# Vivado block design finn_stitched, xczu3eg-sbva484-1-i, Vivado 2020.2
create_bd_design finn_stitched

create_bd_intf_port -mode Slave -vlnv xilinx.com:interface:axis_rtl:1.0 s_axis
set_property -dict [list \
  CONFIG.FREQ_HZ 100000000.000000 \
  CONFIG.HAS_TKEEP 0 \
  CONFIG.HAS_TLAST 0 \
  CONFIG.HAS_TREADY 1 \
  CONFIG.HAS_TSTRB 0 \
  CONFIG.LAYERED_METADATA undef \
  CONFIG.TDATA_NUM_BYTES 1 \
  CONFIG.TDEST_WIDTH 0 \
  CONFIG.TID_WIDTH 0 \
  CONFIG.TUSER_WIDTH 0 \
] [get_bd_intf_ports s_axis]
create_bd_intf_port -mode Master -vlnv xilinx.com:interface:axis_rtl:1.0 m_axis
set_property -dict {CONFIG.FREQ_HZ 100000000.000000} [get_bd_intf_ports m_axis]
create_bd_port -dir I -type clk ap_clk
set_property -dict {CONFIG.FREQ_HZ 100000000.000000} [get_bd_ports ap_clk]
create_bd_port -dir I -type rst ap_rst_n

create_bd_cell -type hier finn_ip

# ---- hierarchy /finn_ip ----
current_bd_instance /finn_ip
create_bd_intf_pin -mode Slave -vlnv xilinx.com:interface:axis_rtl:1.0 s_axis_0
create_bd_intf_pin -mode Master -vlnv xilinx.com:interface:axis_rtl:1.0 m_axis_0
create_bd_pin -dir I -type clk ap_clk
create_bd_pin -dir I -type rst ap_rst_n

create_bd_cell -type ip -vlnv xilinx.com:hls:StreamingFIFO_0:1.0 StreamingFIFO_0
create_bd_cell -type ip -vlnv xilinx.com:hls:Thresholding_Batch_0:1.0 Thresholding_Batch_0
create_bd_cell -type ip -vlnv xilinx.com:hls:StreamingFIFO_1:1.0 StreamingFIFO_1
create_bd_cell -type ip -vlnv xilinx.com:hls:FMPadding_Batch_0:1.0 FMPadding_Batch_0
create_bd_cell -type hier StreamingFIFO_2
create_bd_cell -type ip -vlnv xilinx.com:hls:ConvolutionInputGenerator_0:1.0 ConvolutionInputGenerator_0
create_bd_cell -type ip -vlnv xilinx.com:hls:StreamingDataWidthConverter_Batch_0:1.0 StreamingDataWidthConverter_Batch_0
create_bd_cell -type hier StreamingFIFO_4
create_bd_cell -type hier StreamingFCLayer_Batch_0
create_bd_cell -type ip -vlnv xilinx.com:hls:StreamingDataWidthConverter_Batch_1:1.0 StreamingDataWidthConverter_Batch_1
create_bd_cell -type ip -vlnv xilinx.com:hls:StreamingFIFO_6:1.0 StreamingFIFO_6
create_bd_cell -type ip -vlnv xilinx.com:hls:StreamingMaxPool_Batch_0:1.0 StreamingMaxPool_Batch_0
create_bd_cell -type ip -vlnv xilinx.com:hls:StreamingFIFO_7:1.0 StreamingFIFO_7
create_bd_cell -type ip -vlnv xilinx.com:hls:StreamingDataWidthConverter_Batch_2:1.0 StreamingDataWidthConverter_Batch_2
create_bd_cell -type hier StreamingFIFO_8
create_bd_cell -type ip -vlnv xilinx.com:hls:FMPadding_Batch_1:1.0 FMPadding_Batch_1
create_bd_cell -type ip -vlnv xilinx.com:hls:StreamingDataWidthConverter_Batch_3:1.0 StreamingDataWidthConverter_Batch_3
create_bd_cell -type hier StreamingFIFO_10
create_bd_cell -type ip -vlnv xilinx.com:hls:ConvolutionInputGenerator_1:1.0 ConvolutionInputGenerator_1
create_bd_cell -type ip -vlnv xilinx.com:hls:StreamingDataWidthConverter_Batch_4:1.0 StreamingDataWidthConverter_Batch_4
create_bd_cell -type ip -vlnv xilinx.com:hls:StreamingFIFO_12:1.0 StreamingFIFO_12
create_bd_cell -type hier StreamingFCLayer_Batch_1
create_bd_cell -type ip -vlnv xilinx.com:hls:StreamingDataWidthConverter_Batch_5:1.0 StreamingDataWidthConverter_Batch_5
create_bd_cell -type ip -vlnv xilinx.com:hls:StreamingMaxPool_Batch_1:1.0 StreamingMaxPool_Batch_1
create_bd_cell -type ip -vlnv xilinx.com:hls:StreamingFIFO_15:1.0 StreamingFIFO_15
create_bd_cell -type ip -vlnv xilinx.com:hls:StreamingDataWidthConverter_Batch_6:1.0 StreamingDataWidthConverter_Batch_6
create_bd_cell -type hier StreamingFIFO_16
create_bd_cell -type ip -vlnv xilinx.com:hls:FMPadding_Batch_2:1.0 FMPadding_Batch_2
create_bd_cell -type hier StreamingFIFO_17
create_bd_cell -type ip -vlnv xilinx.com:hls:ConvolutionInputGenerator_2:1.0 ConvolutionInputGenerator_2
create_bd_cell -type ip -vlnv xilinx.com:hls:StreamingDataWidthConverter_Batch_7:1.0 StreamingDataWidthConverter_Batch_7
create_bd_cell -type ip -vlnv xilinx.com:hls:StreamingFIFO_19:1.0 StreamingFIFO_19
create_bd_cell -type hier StreamingFCLayer_Batch_2
create_bd_cell -type ip -vlnv xilinx.com:hls:StreamingDataWidthConverter_Batch_8:1.0 StreamingDataWidthConverter_Batch_8
create_bd_cell -type ip -vlnv xilinx.com:hls:StreamingMaxPool_Batch_2:1.0 StreamingMaxPool_Batch_2
create_bd_cell -type ip -vlnv xilinx.com:hls:StreamingFIFO_22:1.0 StreamingFIFO_22
create_bd_cell -type ip -vlnv xilinx.com:hls:StreamingDataWidthConverter_Batch_9:1.0 StreamingDataWidthConverter_Batch_9
create_bd_cell -type hier StreamingFIFO_23
create_bd_cell -type ip -vlnv xilinx.com:hls:FMPadding_Batch_3:1.0 FMPadding_Batch_3
create_bd_cell -type hier StreamingFIFO_24
create_bd_cell -type ip -vlnv xilinx.com:hls:ConvolutionInputGenerator_3:1.0 ConvolutionInputGenerator_3
create_bd_cell -type ip -vlnv xilinx.com:hls:StreamingDataWidthConverter_Batch_10:1.0 StreamingDataWidthConverter_Batch_10
create_bd_cell -type hier StreamingFIFO_26
create_bd_cell -type hier StreamingFCLayer_Batch_3
create_bd_cell -type ip -vlnv xilinx.com:hls:StreamingDataWidthConverter_Batch_11:1.0 StreamingDataWidthConverter_Batch_11
create_bd_cell -type ip -vlnv xilinx.com:hls:StreamingMaxPool_Batch_3:1.0 StreamingMaxPool_Batch_3
create_bd_cell -type ip -vlnv xilinx.com:hls:StreamingFIFO_29:1.0 StreamingFIFO_29
create_bd_cell -type ip -vlnv xilinx.com:hls:StreamingDataWidthConverter_Batch_12:1.0 StreamingDataWidthConverter_Batch_12
create_bd_cell -type hier StreamingFIFO_30
create_bd_cell -type ip -vlnv xilinx.com:hls:FMPadding_Batch_4:1.0 FMPadding_Batch_4
create_bd_cell -type hier StreamingFIFO_31
create_bd_cell -type ip -vlnv xilinx.com:hls:ConvolutionInputGenerator_4:1.0 ConvolutionInputGenerator_4
create_bd_cell -type ip -vlnv xilinx.com:hls:StreamingDataWidthConverter_Batch_13:1.0 StreamingDataWidthConverter_Batch_13
create_bd_cell -type hier StreamingFIFO_33
create_bd_cell -type hier StreamingFCLayer_Batch_4
create_bd_cell -type ip -vlnv xilinx.com:hls:StreamingDataWidthConverter_Batch_14:1.0 StreamingDataWidthConverter_Batch_14
create_bd_cell -type ip -vlnv xilinx.com:hls:StreamingMaxPool_Batch_4:1.0 StreamingMaxPool_Batch_4
create_bd_cell -type ip -vlnv xilinx.com:hls:StreamingFIFO_36:1.0 StreamingFIFO_36
create_bd_cell -type ip -vlnv xilinx.com:hls:StreamingDataWidthConverter_Batch_15:1.0 StreamingDataWidthConverter_Batch_15
create_bd_cell -type hier StreamingFIFO_37
create_bd_cell -type ip -vlnv xilinx.com:hls:FMPadding_Batch_5:1.0 FMPadding_Batch_5
create_bd_cell -type hier StreamingFIFO_38
create_bd_cell -type ip -vlnv xilinx.com:hls:ConvolutionInputGenerator_5:1.0 ConvolutionInputGenerator_5
create_bd_cell -type ip -vlnv xilinx.com:hls:StreamingDataWidthConverter_Batch_16:1.0 StreamingDataWidthConverter_Batch_16
create_bd_cell -type hier StreamingFIFO_40
create_bd_cell -type hier StreamingFCLayer_Batch_5
create_bd_cell -type ip -vlnv xilinx.com:hls:StreamingDataWidthConverter_Batch_17:1.0 StreamingDataWidthConverter_Batch_17
create_bd_cell -type ip -vlnv xilinx.com:hls:StreamingMaxPool_Batch_5:1.0 StreamingMaxPool_Batch_5
create_bd_cell -type ip -vlnv xilinx.com:hls:StreamingDataWidthConverter_Batch_18:1.0 StreamingDataWidthConverter_Batch_18
create_bd_cell -type hier StreamingFIFO_44
create_bd_cell -type ip -vlnv xilinx.com:hls:FMPadding_Batch_6:1.0 FMPadding_Batch_6
create_bd_cell -type hier StreamingFIFO_45
create_bd_cell -type ip -vlnv xilinx.com:hls:ConvolutionInputGenerator_6:1.0 ConvolutionInputGenerator_6
create_bd_cell -type ip -vlnv xilinx.com:hls:StreamingDataWidthConverter_Batch_19:1.0 StreamingDataWidthConverter_Batch_19
create_bd_cell -type hier StreamingFIFO_47
create_bd_cell -type hier StreamingFCLayer_Batch_6
create_bd_cell -type ip -vlnv xilinx.com:hls:StreamingDataWidthConverter_Batch_20:1.0 StreamingDataWidthConverter_Batch_20
create_bd_cell -type ip -vlnv xilinx.com:hls:StreamingMaxPool_Batch_6:1.0 StreamingMaxPool_Batch_6
create_bd_cell -type ip -vlnv xilinx.com:hls:StreamingDataWidthConverter_Batch_21:1.0 StreamingDataWidthConverter_Batch_21
create_bd_cell -type hier StreamingFCLayer_Batch_7
create_bd_cell -type ip -vlnv xilinx.com:hls:StreamingDataWidthConverter_Batch_22:1.0 StreamingDataWidthConverter_Batch_22
create_bd_cell -type hier StreamingFCLayer_Batch_8
create_bd_cell -type ip -vlnv xilinx.com:hls:StreamingDataWidthConverter_Batch_23:1.0 StreamingDataWidthConverter_Batch_23
create_bd_cell -type hier StreamingFCLayer_Batch_9

# ---- hierarchy /finn_ip/StreamingFIFO_2 ----
current_bd_instance /finn_ip/StreamingFIFO_2
create_bd_intf_pin -mode Master -vlnv xilinx.com:interface:axis_rtl:1.0 out_V
create_bd_intf_pin -mode Slave -vlnv xilinx.com:interface:axis_rtl:1.0 in0_V
create_bd_pin -dir I -type clk ap_clk
create_bd_pin -dir I -type rst ap_rst_n

create_bd_cell -type ip -vlnv xilinx.com:ip:axis_data_fifo:2.0 fifo
set_property -dict {CONFIG.FIFO_DEPTH 4096 CONFIG.FIFO_MEMORY_TYPE auto CONFIG.TDATA_NUM_BYTES 1} [get_bd_cells fifo]

# ---- hierarchy /finn_ip/StreamingFIFO_4 ----
current_bd_instance /finn_ip/StreamingFIFO_4
create_bd_intf_pin -mode Master -vlnv xilinx.com:interface:axis_rtl:1.0 out_V
create_bd_intf_pin -mode Slave -vlnv xilinx.com:interface:axis_rtl:1.0 in0_V
create_bd_pin -dir I -type clk ap_clk
create_bd_pin -dir I -type rst ap_rst_n

create_bd_cell -type ip -vlnv xilinx.com:ip:axis_data_fifo:2.0 fifo
set_property -dict {CONFIG.FIFO_DEPTH 2048 CONFIG.FIFO_MEMORY_TYPE auto CONFIG.TDATA_NUM_BYTES 3} [get_bd_cells fifo]

# ---- hierarchy /finn_ip/StreamingFCLayer_Batch_0 ----
current_bd_instance /finn_ip/StreamingFCLayer_Batch_0
create_bd_intf_pin -mode Master -vlnv xilinx.com:interface:axis_rtl:1.0 out_V
create_bd_intf_pin -mode Slave -vlnv xilinx.com:interface:axis_rtl:1.0 in0_V
create_bd_pin -dir I -type clk ap_clk
create_bd_pin -dir I -type rst ap_rst_n

create_bd_cell -type ip -vlnv xilinx.com:hls:StreamingFCLayer_Batch_0:1.0 StreamingFCLayer_Batch_0
create_bd_cell -type ip -vlnv xilinx.com:user:memstream:1.0 StreamingFCLayer_Batch_0_wstrm
set_property -dict [list \
  CONFIG.MEM_DEPTH 36 \
  CONFIG.MEM_INIT /home/nm/FINN/hls_2020_2/finn/notebooks/end2end_example/cnv_w1a2_resize_regression_ressource/source_IPs/src_ips/code_gen_ipgen_StreamingFCLayer_Batch_0_kivh_mzu/ \
  CONFIG.MEM_WIDTH 48 \
  CONFIG.NSTREAMS 1 \
  CONFIG.RAM_STYLE distributed \
  CONFIG.STRM0_DEPTH 36 \
  CONFIG.STRM0_OFFSET 0 \
  CONFIG.STRM0_WIDTH 48 \
] [get_bd_cells StreamingFCLayer_Batch_0_wstrm]

# ---- hierarchy /finn_ip/StreamingFIFO_8 ----
current_bd_instance /finn_ip/StreamingFIFO_8
create_bd_intf_pin -mode Master -vlnv xilinx.com:interface:axis_rtl:1.0 out_V
create_bd_intf_pin -mode Slave -vlnv xilinx.com:interface:axis_rtl:1.0 in0_V
create_bd_pin -dir I -type clk ap_clk
create_bd_pin -dir I -type rst ap_rst_n

create_bd_cell -type ip -vlnv xilinx.com:ip:axis_data_fifo:2.0 fifo
set_property -dict {CONFIG.FIFO_DEPTH 1024 CONFIG.FIFO_MEMORY_TYPE auto CONFIG.TDATA_NUM_BYTES 1} [get_bd_cells fifo]

# ---- hierarchy /finn_ip/StreamingFIFO_10 ----
current_bd_instance /finn_ip/StreamingFIFO_10
create_bd_intf_pin -mode Master -vlnv xilinx.com:interface:axis_rtl:1.0 out_V
create_bd_intf_pin -mode Slave -vlnv xilinx.com:interface:axis_rtl:1.0 in0_V
create_bd_pin -dir I -type clk ap_clk
create_bd_pin -dir I -type rst ap_rst_n

create_bd_cell -type ip -vlnv xilinx.com:ip:axis_data_fifo:2.0 fifo
set_property -dict {CONFIG.FIFO_DEPTH 8192 CONFIG.FIFO_MEMORY_TYPE auto CONFIG.TDATA_NUM_BYTES 1} [get_bd_cells fifo]

# ---- hierarchy /finn_ip/StreamingFCLayer_Batch_1 ----
current_bd_instance /finn_ip/StreamingFCLayer_Batch_1
create_bd_intf_pin -mode Master -vlnv xilinx.com:interface:axis_rtl:1.0 out_V
create_bd_intf_pin -mode Slave -vlnv xilinx.com:interface:axis_rtl:1.0 in0_V
create_bd_pin -dir I -type clk ap_clk
create_bd_pin -dir I -type rst ap_rst_n

create_bd_cell -type ip -vlnv xilinx.com:hls:StreamingFCLayer_Batch_1:1.0 StreamingFCLayer_Batch_1
create_bd_cell -type ip -vlnv xilinx.com:user:memstream:1.0 StreamingFCLayer_Batch_1_wstrm
set_property -dict [list \
  CONFIG.MEM_DEPTH 144 \
  CONFIG.MEM_INIT /home/nm/FINN/hls_2020_2/finn/notebooks/end2end_example/cnv_w1a2_resize_regression_ressource/source_IPs/src_ips/code_gen_ipgen_StreamingFCLayer_Batch_1_ngxwpf97/ \
  CONFIG.MEM_WIDTH 256 \
  CONFIG.NSTREAMS 1 \
  CONFIG.RAM_STYLE distributed \
  CONFIG.STRM0_DEPTH 144 \
  CONFIG.STRM0_OFFSET 0 \
  CONFIG.STRM0_WIDTH 256 \
] [get_bd_cells StreamingFCLayer_Batch_1_wstrm]

# ---- hierarchy /finn_ip/StreamingFIFO_16 ----
current_bd_instance /finn_ip/StreamingFIFO_16
create_bd_intf_pin -mode Master -vlnv xilinx.com:interface:axis_rtl:1.0 out_V
create_bd_intf_pin -mode Slave -vlnv xilinx.com:interface:axis_rtl:1.0 in0_V
create_bd_pin -dir I -type clk ap_clk
create_bd_pin -dir I -type rst ap_rst_n

create_bd_cell -type ip -vlnv xilinx.com:ip:axis_data_fifo:2.0 fifo
set_property -dict {CONFIG.FIFO_DEPTH 512 CONFIG.FIFO_MEMORY_TYPE auto CONFIG.TDATA_NUM_BYTES 1} [get_bd_cells fifo]

# ---- hierarchy /finn_ip/StreamingFIFO_17 ----
current_bd_instance /finn_ip/StreamingFIFO_17
create_bd_intf_pin -mode Master -vlnv xilinx.com:interface:axis_rtl:1.0 out_V
create_bd_intf_pin -mode Slave -vlnv xilinx.com:interface:axis_rtl:1.0 in0_V
create_bd_pin -dir I -type clk ap_clk
create_bd_pin -dir I -type rst ap_rst_n

create_bd_cell -type ip -vlnv xilinx.com:ip:axis_data_fifo:2.0 fifo
set_property -dict {CONFIG.FIFO_DEPTH 16384 CONFIG.FIFO_MEMORY_TYPE auto CONFIG.TDATA_NUM_BYTES 1} [get_bd_cells fifo]

# ---- hierarchy /finn_ip/StreamingFCLayer_Batch_2 ----
current_bd_instance /finn_ip/StreamingFCLayer_Batch_2
create_bd_intf_pin -mode Master -vlnv xilinx.com:interface:axis_rtl:1.0 out_V
create_bd_intf_pin -mode Slave -vlnv xilinx.com:interface:axis_rtl:1.0 in0_V
create_bd_pin -dir I -type clk ap_clk
create_bd_pin -dir I -type rst ap_rst_n

create_bd_cell -type ip -vlnv xilinx.com:hls:StreamingFCLayer_Batch_2:1.0 StreamingFCLayer_Batch_2
create_bd_cell -type ip -vlnv xilinx.com:user:memstream:1.0 StreamingFCLayer_Batch_2_wstrm
set_property -dict [list \
  CONFIG.MEM_DEPTH 576 \
  CONFIG.MEM_INIT /home/nm/FINN/hls_2020_2/finn/notebooks/end2end_example/cnv_w1a2_resize_regression_ressource/source_IPs/src_ips/code_gen_ipgen_StreamingFCLayer_Batch_2_9ao_flvf/ \
  CONFIG.MEM_WIDTH 128 \
  CONFIG.NSTREAMS 1 \
  CONFIG.RAM_STYLE distributed \
  CONFIG.STRM0_DEPTH 576 \
  CONFIG.STRM0_OFFSET 0 \
  CONFIG.STRM0_WIDTH 128 \
] [get_bd_cells StreamingFCLayer_Batch_2_wstrm]

# ---- hierarchy /finn_ip/StreamingFIFO_23 ----
current_bd_instance /finn_ip/StreamingFIFO_23
create_bd_intf_pin -mode Master -vlnv xilinx.com:interface:axis_rtl:1.0 out_V
create_bd_intf_pin -mode Slave -vlnv xilinx.com:interface:axis_rtl:1.0 in0_V
create_bd_pin -dir I -type clk ap_clk
create_bd_pin -dir I -type rst ap_rst_n

create_bd_cell -type ip -vlnv xilinx.com:ip:axis_data_fifo:2.0 fifo
set_property -dict {CONFIG.FIFO_DEPTH 512 CONFIG.FIFO_MEMORY_TYPE auto CONFIG.TDATA_NUM_BYTES 1} [get_bd_cells fifo]

# ---- hierarchy /finn_ip/StreamingFIFO_24 ----
current_bd_instance /finn_ip/StreamingFIFO_24
create_bd_intf_pin -mode Master -vlnv xilinx.com:interface:axis_rtl:1.0 out_V
create_bd_intf_pin -mode Slave -vlnv xilinx.com:interface:axis_rtl:1.0 in0_V
create_bd_pin -dir I -type clk ap_clk
create_bd_pin -dir I -type rst ap_rst_n

create_bd_cell -type ip -vlnv xilinx.com:ip:axis_data_fifo:2.0 fifo
set_property -dict {CONFIG.FIFO_DEPTH 16384 CONFIG.FIFO_MEMORY_TYPE auto CONFIG.TDATA_NUM_BYTES 1} [get_bd_cells fifo]

# ---- hierarchy /finn_ip/StreamingFIFO_26 ----
current_bd_instance /finn_ip/StreamingFIFO_26
create_bd_intf_pin -mode Master -vlnv xilinx.com:interface:axis_rtl:1.0 out_V
create_bd_intf_pin -mode Slave -vlnv xilinx.com:interface:axis_rtl:1.0 in0_V
create_bd_pin -dir I -type clk ap_clk
create_bd_pin -dir I -type rst ap_rst_n

create_bd_cell -type ip -vlnv xilinx.com:ip:axis_data_fifo:2.0 fifo
set_property -dict {CONFIG.FIFO_DEPTH 8192 CONFIG.FIFO_MEMORY_TYPE auto CONFIG.TDATA_NUM_BYTES 4} [get_bd_cells fifo]

# ---- hierarchy /finn_ip/StreamingFCLayer_Batch_3 ----
current_bd_instance /finn_ip/StreamingFCLayer_Batch_3
create_bd_intf_pin -mode Master -vlnv xilinx.com:interface:axis_rtl:1.0 out_V
create_bd_intf_pin -mode Slave -vlnv xilinx.com:interface:axis_rtl:1.0 in0_V
create_bd_pin -dir I -type clk ap_clk
create_bd_pin -dir I -type rst ap_rst_n

create_bd_cell -type ip -vlnv xilinx.com:hls:StreamingFCLayer_Batch_3:1.0 StreamingFCLayer_Batch_3
create_bd_cell -type ip -vlnv xilinx.com:user:memstream:1.0 StreamingFCLayer_Batch_3_wstrm
set_property -dict [list \
  CONFIG.MEM_DEPTH 2304 \
  CONFIG.MEM_INIT /home/nm/FINN/hls_2020_2/finn/notebooks/end2end_example/cnv_w1a2_resize_regression_ressource/source_IPs/src_ips/code_gen_ipgen_StreamingFCLayer_Batch_3_rdf8am5y/ \
  CONFIG.MEM_WIDTH 64 \
  CONFIG.NSTREAMS 1 \
  CONFIG.RAM_STYLE distributed \
  CONFIG.STRM0_DEPTH 2304 \
  CONFIG.STRM0_OFFSET 0 \
  CONFIG.STRM0_WIDTH 64 \
] [get_bd_cells StreamingFCLayer_Batch_3_wstrm]

# ---- hierarchy /finn_ip/StreamingFIFO_30 ----
current_bd_instance /finn_ip/StreamingFIFO_30
create_bd_intf_pin -mode Master -vlnv xilinx.com:interface:axis_rtl:1.0 out_V
create_bd_intf_pin -mode Slave -vlnv xilinx.com:interface:axis_rtl:1.0 in0_V
create_bd_pin -dir I -type clk ap_clk
create_bd_pin -dir I -type rst ap_rst_n

create_bd_cell -type ip -vlnv xilinx.com:ip:axis_data_fifo:2.0 fifo
set_property -dict {CONFIG.FIFO_DEPTH 512 CONFIG.FIFO_MEMORY_TYPE auto CONFIG.TDATA_NUM_BYTES 1} [get_bd_cells fifo]

# ---- hierarchy /finn_ip/StreamingFIFO_31 ----
current_bd_instance /finn_ip/StreamingFIFO_31
create_bd_intf_pin -mode Master -vlnv xilinx.com:interface:axis_rtl:1.0 out_V
create_bd_intf_pin -mode Slave -vlnv xilinx.com:interface:axis_rtl:1.0 in0_V
create_bd_pin -dir I -type clk ap_clk
create_bd_pin -dir I -type rst ap_rst_n

create_bd_cell -type ip -vlnv xilinx.com:ip:axis_data_fifo:2.0 fifo
set_property -dict {CONFIG.FIFO_DEPTH 8192 CONFIG.FIFO_MEMORY_TYPE auto CONFIG.TDATA_NUM_BYTES 1} [get_bd_cells fifo]

# ---- hierarchy /finn_ip/StreamingFIFO_33 ----
current_bd_instance /finn_ip/StreamingFIFO_33
create_bd_intf_pin -mode Master -vlnv xilinx.com:interface:axis_rtl:1.0 out_V
create_bd_intf_pin -mode Slave -vlnv xilinx.com:interface:axis_rtl:1.0 in0_V
create_bd_pin -dir I -type clk ap_clk
create_bd_pin -dir I -type rst ap_rst_n

create_bd_cell -type ip -vlnv xilinx.com:ip:axis_data_fifo:2.0 fifo
set_property -dict {CONFIG.FIFO_DEPTH 4096 CONFIG.FIFO_MEMORY_TYPE auto CONFIG.TDATA_NUM_BYTES 4} [get_bd_cells fifo]

# ---- hierarchy /finn_ip/StreamingFCLayer_Batch_4 ----
current_bd_instance /finn_ip/StreamingFCLayer_Batch_4
create_bd_intf_pin -mode Master -vlnv xilinx.com:interface:axis_rtl:1.0 out_V
create_bd_intf_pin -mode Slave -vlnv xilinx.com:interface:axis_rtl:1.0 in0_V
create_bd_pin -dir I -type clk ap_clk
create_bd_pin -dir I -type rst ap_rst_n

create_bd_cell -type ip -vlnv xilinx.com:hls:StreamingFCLayer_Batch_4:1.0 StreamingFCLayer_Batch_4
create_bd_cell -type ip -vlnv xilinx.com:user:memstream:1.0 StreamingFCLayer_Batch_4_wstrm
set_property -dict [list \
  CONFIG.MEM_DEPTH 9216 \
  CONFIG.MEM_INIT /home/nm/FINN/hls_2020_2/finn/notebooks/end2end_example/cnv_w1a2_resize_regression_ressource/source_IPs/src_ips/code_gen_ipgen_StreamingFCLayer_Batch_4_yxvt0poh/ \
  CONFIG.MEM_WIDTH 32 \
  CONFIG.NSTREAMS 1 \
  CONFIG.RAM_STYLE block \
  CONFIG.STRM0_DEPTH 9216 \
  CONFIG.STRM0_OFFSET 0 \
  CONFIG.STRM0_WIDTH 32 \
] [get_bd_cells StreamingFCLayer_Batch_4_wstrm]

# ---- hierarchy /finn_ip/StreamingFIFO_37 ----
current_bd_instance /finn_ip/StreamingFIFO_37
create_bd_intf_pin -mode Master -vlnv xilinx.com:interface:axis_rtl:1.0 out_V
create_bd_intf_pin -mode Slave -vlnv xilinx.com:interface:axis_rtl:1.0 in0_V
create_bd_pin -dir I -type clk ap_clk
create_bd_pin -dir I -type rst ap_rst_n

create_bd_cell -type ip -vlnv xilinx.com:ip:axis_data_fifo:2.0 fifo
set_property -dict {CONFIG.FIFO_DEPTH 1024 CONFIG.FIFO_MEMORY_TYPE auto CONFIG.TDATA_NUM_BYTES 1} [get_bd_cells fifo]

# ---- hierarchy /finn_ip/StreamingFIFO_38 ----
current_bd_instance /finn_ip/StreamingFIFO_38
create_bd_intf_pin -mode Master -vlnv xilinx.com:interface:axis_rtl:1.0 out_V
create_bd_intf_pin -mode Slave -vlnv xilinx.com:interface:axis_rtl:1.0 in0_V
create_bd_pin -dir I -type clk ap_clk
create_bd_pin -dir I -type rst ap_rst_n

create_bd_cell -type ip -vlnv xilinx.com:ip:axis_data_fifo:2.0 fifo
set_property -dict {CONFIG.FIFO_DEPTH 8192 CONFIG.FIFO_MEMORY_TYPE auto CONFIG.TDATA_NUM_BYTES 1} [get_bd_cells fifo]

# ---- hierarchy /finn_ip/StreamingFIFO_40 ----
current_bd_instance /finn_ip/StreamingFIFO_40
create_bd_intf_pin -mode Master -vlnv xilinx.com:interface:axis_rtl:1.0 out_V
create_bd_intf_pin -mode Slave -vlnv xilinx.com:interface:axis_rtl:1.0 in0_V
create_bd_pin -dir I -type clk ap_clk
create_bd_pin -dir I -type rst ap_rst_n

create_bd_cell -type ip -vlnv xilinx.com:ip:axis_data_fifo:2.0 fifo
set_property -dict {CONFIG.FIFO_DEPTH 16384 CONFIG.FIFO_MEMORY_TYPE auto CONFIG.TDATA_NUM_BYTES 2} [get_bd_cells fifo]

# ---- hierarchy /finn_ip/StreamingFCLayer_Batch_5 ----
current_bd_instance /finn_ip/StreamingFCLayer_Batch_5
create_bd_intf_pin -mode Master -vlnv xilinx.com:interface:axis_rtl:1.0 out_V
create_bd_intf_pin -mode Slave -vlnv xilinx.com:interface:axis_rtl:1.0 in0_V
create_bd_pin -dir I -type clk ap_clk
create_bd_pin -dir I -type rst ap_rst_n

create_bd_cell -type ip -vlnv xilinx.com:hls:StreamingFCLayer_Batch_5:1.0 StreamingFCLayer_Batch_5
create_bd_cell -type ip -vlnv xilinx.com:user:memstream:1.0 StreamingFCLayer_Batch_5_wstrm
set_property -dict [list \
  CONFIG.MEM_DEPTH 36864 \
  CONFIG.MEM_INIT /home/nm/FINN/hls_2020_2/finn/notebooks/end2end_example/cnv_w1a2_resize_regression_ressource/source_IPs/src_ips/code_gen_ipgen_StreamingFCLayer_Batch_5_u8mvjgu2/ \
  CONFIG.MEM_WIDTH 16 \
  CONFIG.NSTREAMS 1 \
  CONFIG.RAM_STYLE block \
  CONFIG.STRM0_DEPTH 36864 \
  CONFIG.STRM0_OFFSET 0 \
  CONFIG.STRM0_WIDTH 16 \
] [get_bd_cells StreamingFCLayer_Batch_5_wstrm]

# ---- hierarchy /finn_ip/StreamingFIFO_44 ----
current_bd_instance /finn_ip/StreamingFIFO_44
create_bd_intf_pin -mode Master -vlnv xilinx.com:interface:axis_rtl:1.0 out_V
create_bd_intf_pin -mode Slave -vlnv xilinx.com:interface:axis_rtl:1.0 in0_V
create_bd_pin -dir I -type clk ap_clk
create_bd_pin -dir I -type rst ap_rst_n

create_bd_cell -type ip -vlnv xilinx.com:ip:axis_data_fifo:2.0 fifo
set_property -dict {CONFIG.FIFO_DEPTH 1024 CONFIG.FIFO_MEMORY_TYPE auto CONFIG.TDATA_NUM_BYTES 1} [get_bd_cells fifo]

# ---- hierarchy /finn_ip/StreamingFIFO_45 ----
current_bd_instance /finn_ip/StreamingFIFO_45
create_bd_intf_pin -mode Master -vlnv xilinx.com:interface:axis_rtl:1.0 out_V
create_bd_intf_pin -mode Slave -vlnv xilinx.com:interface:axis_rtl:1.0 in0_V
create_bd_pin -dir I -type clk ap_clk
create_bd_pin -dir I -type rst ap_rst_n

create_bd_cell -type ip -vlnv xilinx.com:ip:axis_data_fifo:2.0 fifo
set_property -dict {CONFIG.FIFO_DEPTH 8192 CONFIG.FIFO_MEMORY_TYPE auto CONFIG.TDATA_NUM_BYTES 1} [get_bd_cells fifo]

# ---- hierarchy /finn_ip/StreamingFIFO_47 ----
current_bd_instance /finn_ip/StreamingFIFO_47
create_bd_intf_pin -mode Master -vlnv xilinx.com:interface:axis_rtl:1.0 out_V
create_bd_intf_pin -mode Slave -vlnv xilinx.com:interface:axis_rtl:1.0 in0_V
create_bd_pin -dir I -type clk ap_clk
create_bd_pin -dir I -type rst ap_rst_n

create_bd_cell -type ip -vlnv xilinx.com:ip:axis_data_fifo:2.0 fifo
set_property -dict {CONFIG.FIFO_DEPTH 8192 CONFIG.FIFO_MEMORY_TYPE auto CONFIG.TDATA_NUM_BYTES 2} [get_bd_cells fifo]

# ---- hierarchy /finn_ip/StreamingFCLayer_Batch_6 ----
current_bd_instance /finn_ip/StreamingFCLayer_Batch_6
create_bd_intf_pin -mode Master -vlnv xilinx.com:interface:axis_rtl:1.0 out_V
create_bd_intf_pin -mode Slave -vlnv xilinx.com:interface:axis_rtl:1.0 in0_V
create_bd_pin -dir I -type clk ap_clk
create_bd_pin -dir I -type rst ap_rst_n

create_bd_cell -type ip -vlnv xilinx.com:hls:StreamingFCLayer_Batch_6:1.0 StreamingFCLayer_Batch_6
create_bd_cell -type ip -vlnv xilinx.com:user:memstream:1.0 StreamingFCLayer_Batch_6_wstrm
set_property -dict [list \
  CONFIG.MEM_DEPTH 73728 \
  CONFIG.MEM_INIT /home/nm/FINN/hls_2020_2/finn/notebooks/end2end_example/cnv_w1a2_resize_regression_ressource/source_IPs/src_ips/code_gen_ipgen_StreamingFCLayer_Batch_6_h23mbxdx/ \
  CONFIG.MEM_WIDTH 8 \
  CONFIG.NSTREAMS 1 \
  CONFIG.RAM_STYLE block \
  CONFIG.STRM0_DEPTH 73728 \
  CONFIG.STRM0_OFFSET 0 \
  CONFIG.STRM0_WIDTH 8 \
] [get_bd_cells StreamingFCLayer_Batch_6_wstrm]

# ---- hierarchy /finn_ip/StreamingFCLayer_Batch_7 ----
current_bd_instance /finn_ip/StreamingFCLayer_Batch_7
create_bd_intf_pin -mode Master -vlnv xilinx.com:interface:axis_rtl:1.0 out_V
create_bd_intf_pin -mode Slave -vlnv xilinx.com:interface:axis_rtl:1.0 in0_V
create_bd_pin -dir I -type clk ap_clk
create_bd_pin -dir I -type rst ap_rst_n

create_bd_cell -type ip -vlnv xilinx.com:hls:StreamingFCLayer_Batch_7:1.0 StreamingFCLayer_Batch_7
create_bd_cell -type ip -vlnv xilinx.com:user:memstream:1.0 StreamingFCLayer_Batch_7_wstrm
set_property -dict [list \
  CONFIG.MEM_DEPTH 65536 \
  CONFIG.MEM_INIT /home/nm/FINN/hls_2020_2/finn/notebooks/end2end_example/cnv_w1a2_resize_regression_ressource/source_IPs/src_ips/code_gen_ipgen_StreamingFCLayer_Batch_7_ifvft2ge/ \
  CONFIG.MEM_WIDTH 8 \
  CONFIG.NSTREAMS 1 \
  CONFIG.RAM_STYLE block \
  CONFIG.STRM0_DEPTH 65536 \
  CONFIG.STRM0_OFFSET 0 \
  CONFIG.STRM0_WIDTH 8 \
] [get_bd_cells StreamingFCLayer_Batch_7_wstrm]

# ---- hierarchy /finn_ip/StreamingFCLayer_Batch_8 ----
current_bd_instance /finn_ip/StreamingFCLayer_Batch_8
create_bd_intf_pin -mode Master -vlnv xilinx.com:interface:axis_rtl:1.0 out_V
create_bd_intf_pin -mode Slave -vlnv xilinx.com:interface:axis_rtl:1.0 in0_V
create_bd_pin -dir I -type clk ap_clk
create_bd_pin -dir I -type rst ap_rst_n

create_bd_cell -type ip -vlnv xilinx.com:hls:StreamingFCLayer_Batch_8:1.0 StreamingFCLayer_Batch_8
create_bd_cell -type ip -vlnv xilinx.com:user:memstream:1.0 StreamingFCLayer_Batch_8_wstrm
set_property -dict [list \
  CONFIG.MEM_DEPTH 8192 \
  CONFIG.MEM_INIT /home/nm/FINN/hls_2020_2/finn/notebooks/end2end_example/cnv_w1a2_resize_regression_ressource/source_IPs/src_ips/code_gen_ipgen_StreamingFCLayer_Batch_8_pmijdtqk/ \
  CONFIG.MEM_WIDTH 8 \
  CONFIG.NSTREAMS 1 \
  CONFIG.RAM_STYLE block \
  CONFIG.STRM0_DEPTH 8192 \
  CONFIG.STRM0_OFFSET 0 \
  CONFIG.STRM0_WIDTH 8 \
] [get_bd_cells StreamingFCLayer_Batch_8_wstrm]

# ---- hierarchy /finn_ip/StreamingFCLayer_Batch_9 ----
current_bd_instance /finn_ip/StreamingFCLayer_Batch_9
create_bd_intf_pin -mode Master -vlnv xilinx.com:interface:axis_rtl:1.0 out_V
create_bd_intf_pin -mode Slave -vlnv xilinx.com:interface:axis_rtl:1.0 in0_V
create_bd_pin -dir I -type clk ap_clk
create_bd_pin -dir I -type rst ap_rst_n

create_bd_cell -type ip -vlnv xilinx.com:hls:StreamingFCLayer_Batch_9:1.0 StreamingFCLayer_Batch_9
create_bd_cell -type ip -vlnv xilinx.com:user:memstream:1.0 StreamingFCLayer_Batch_9_wstrm
set_property -dict [list \
  CONFIG.MEM_DEPTH 64 \
  CONFIG.MEM_INIT /home/nm/FINN/hls_2020_2/finn/notebooks/end2end_example/cnv_w1a2_resize_regression_ressource/source_IPs/src_ips/code_gen_ipgen_StreamingFCLayer_Batch_9_a_k80z9h/ \
  CONFIG.MEM_WIDTH 16 \
  CONFIG.NSTREAMS 1 \
  CONFIG.RAM_STYLE distributed \
  CONFIG.STRM0_DEPTH 64 \
  CONFIG.STRM0_OFFSET 0 \
  CONFIG.STRM0_WIDTH 16 \
] [get_bd_cells StreamingFCLayer_Batch_9_wstrm]

# ---- connections ----

current_bd_instance /finn_ip
connect_bd_intf_net [get_bd_intf_pins ConvolutionInputGenerator_3/out_V] [get_bd_intf_pins StreamingDataWidthConverter_Batch_10/in0_V]
connect_bd_intf_net [get_bd_intf_pins StreamingDataWidthConverter_Batch_18/out_V] [get_bd_intf_pins StreamingFIFO_44/in0_V]
connect_bd_intf_net [get_bd_intf_pins StreamingDataWidthConverter_Batch_17/out_V] [get_bd_intf_pins StreamingMaxPool_Batch_5/in0_V]
connect_bd_intf_net [get_bd_intf_pins StreamingDataWidthConverter_Batch_13/out_V] [get_bd_intf_pins StreamingFIFO_33/in0_V]
connect_bd_intf_net [get_bd_intf_pins StreamingMaxPool_Batch_5/out_V] [get_bd_intf_pins StreamingDataWidthConverter_Batch_18/in0_V]
connect_bd_intf_net [get_bd_intf_pins StreamingFIFO_31/out_V] [get_bd_intf_pins ConvolutionInputGenerator_4/in0_V]
connect_bd_intf_net [get_bd_intf_pins FMPadding_Batch_2/out_V] [get_bd_intf_pins StreamingFIFO_17/in0_V]
connect_bd_intf_net [get_bd_intf_pins StreamingMaxPool_Batch_2/out_V] [get_bd_intf_pins StreamingFIFO_22/in0_V]
connect_bd_intf_net [get_bd_intf_pins s_axis_0] [get_bd_intf_pins StreamingFIFO_0/in0_V]
connect_bd_intf_net [get_bd_intf_pins m_axis_0] [get_bd_intf_pins StreamingFCLayer_Batch_9/out_V]
connect_bd_intf_net [get_bd_intf_pins StreamingDataWidthConverter_Batch_3/out_V] [get_bd_intf_pins StreamingFIFO_10/in0_V]
connect_bd_intf_net [get_bd_intf_pins ConvolutionInputGenerator_6/out_V] [get_bd_intf_pins StreamingDataWidthConverter_Batch_19/in0_V]
connect_bd_intf_net [get_bd_intf_pins StreamingFIFO_24/out_V] [get_bd_intf_pins ConvolutionInputGenerator_3/in0_V]
connect_bd_intf_net [get_bd_intf_pins ConvolutionInputGenerator_2/out_V] [get_bd_intf_pins StreamingDataWidthConverter_Batch_7/in0_V]
connect_bd_intf_net [get_bd_intf_pins StreamingDataWidthConverter_Batch_11/out_V] [get_bd_intf_pins StreamingMaxPool_Batch_3/in0_V]
connect_bd_intf_net [get_bd_intf_pins StreamingFIFO_16/out_V] [get_bd_intf_pins FMPadding_Batch_2/in0_V]
connect_bd_intf_net [get_bd_intf_pins FMPadding_Batch_0/out_V] [get_bd_intf_pins StreamingFIFO_2/in0_V]
connect_bd_intf_net [get_bd_intf_pins StreamingFIFO_4/out_V] [get_bd_intf_pins StreamingFCLayer_Batch_0/in0_V]
connect_bd_intf_net [get_bd_intf_pins StreamingFCLayer_Batch_0/out_V] [get_bd_intf_pins StreamingDataWidthConverter_Batch_1/in0_V]
connect_bd_intf_net [get_bd_intf_pins StreamingDataWidthConverter_Batch_1/out_V] [get_bd_intf_pins StreamingFIFO_6/in0_V]
connect_bd_intf_net [get_bd_intf_pins ConvolutionInputGenerator_0/out_V] [get_bd_intf_pins StreamingDataWidthConverter_Batch_0/in0_V]
connect_bd_intf_net [get_bd_intf_pins StreamingDataWidthConverter_Batch_19/out_V] [get_bd_intf_pins StreamingFIFO_47/in0_V]
connect_bd_intf_net [get_bd_intf_pins StreamingFIFO_47/out_V] [get_bd_intf_pins StreamingFCLayer_Batch_6/in0_V]
connect_bd_intf_net [get_bd_intf_pins ConvolutionInputGenerator_1/out_V] [get_bd_intf_pins StreamingDataWidthConverter_Batch_4/in0_V]
connect_bd_intf_net [get_bd_intf_pins StreamingDataWidthConverter_Batch_8/out_V] [get_bd_intf_pins StreamingMaxPool_Batch_2/in0_V]
connect_bd_intf_net [get_bd_intf_pins StreamingFIFO_12/out_V] [get_bd_intf_pins StreamingFCLayer_Batch_1/in0_V]
connect_bd_intf_net [get_bd_intf_pins StreamingDataWidthConverter_Batch_22/out_V] [get_bd_intf_pins StreamingFCLayer_Batch_8/in0_V]
connect_bd_intf_net [get_bd_intf_pins StreamingDataWidthConverter_Batch_23/out_V] [get_bd_intf_pins StreamingFCLayer_Batch_9/in0_V]
connect_bd_intf_net [get_bd_intf_pins StreamingFCLayer_Batch_8/out_V] [get_bd_intf_pins StreamingDataWidthConverter_Batch_23/in0_V]
connect_bd_intf_net [get_bd_intf_pins StreamingFIFO_8/out_V] [get_bd_intf_pins FMPadding_Batch_1/in0_V]
connect_bd_intf_net [get_bd_intf_pins StreamingDataWidthConverter_Batch_14/out_V] [get_bd_intf_pins StreamingMaxPool_Batch_4/in0_V]
connect_bd_intf_net [get_bd_intf_pins StreamingFCLayer_Batch_4/out_V] [get_bd_intf_pins StreamingDataWidthConverter_Batch_14/in0_V]
connect_bd_intf_net [get_bd_intf_pins StreamingFCLayer_Batch_7/out_V] [get_bd_intf_pins StreamingDataWidthConverter_Batch_22/in0_V]
connect_bd_intf_net [get_bd_intf_pins StreamingDataWidthConverter_Batch_21/out_V] [get_bd_intf_pins StreamingFCLayer_Batch_7/in0_V]
connect_bd_intf_net [get_bd_intf_pins StreamingFIFO_29/out_V] [get_bd_intf_pins StreamingDataWidthConverter_Batch_12/in0_V]
connect_bd_intf_net [get_bd_intf_pins StreamingFIFO_37/out_V] [get_bd_intf_pins FMPadding_Batch_5/in0_V]
connect_bd_intf_net [get_bd_intf_pins FMPadding_Batch_5/out_V] [get_bd_intf_pins StreamingFIFO_38/in0_V]
connect_bd_intf_net [get_bd_intf_pins StreamingFIFO_36/out_V] [get_bd_intf_pins StreamingDataWidthConverter_Batch_15/in0_V]
connect_bd_intf_net [get_bd_intf_pins StreamingFCLayer_Batch_2/out_V] [get_bd_intf_pins StreamingDataWidthConverter_Batch_8/in0_V]
connect_bd_intf_net [get_bd_intf_pins Thresholding_Batch_0/out_V] [get_bd_intf_pins StreamingFIFO_1/in0_V]
connect_bd_intf_net [get_bd_intf_pins StreamingFIFO_33/out_V] [get_bd_intf_pins StreamingFCLayer_Batch_4/in0_V]
connect_bd_intf_net [get_bd_intf_pins StreamingMaxPool_Batch_4/out_V] [get_bd_intf_pins StreamingFIFO_36/in0_V]
connect_bd_intf_net [get_bd_intf_pins StreamingDataWidthConverter_Batch_15/out_V] [get_bd_intf_pins StreamingFIFO_37/in0_V]
connect_bd_intf_net [get_bd_intf_pins StreamingFIFO_38/out_V] [get_bd_intf_pins ConvolutionInputGenerator_5/in0_V]
connect_bd_intf_net [get_bd_intf_pins StreamingDataWidthConverter_Batch_16/out_V] [get_bd_intf_pins StreamingFIFO_40/in0_V]
connect_bd_intf_net [get_bd_intf_pins StreamingFIFO_44/out_V] [get_bd_intf_pins FMPadding_Batch_6/in0_V]
connect_bd_intf_net [get_bd_intf_pins StreamingFIFO_7/out_V] [get_bd_intf_pins StreamingDataWidthConverter_Batch_2/in0_V]
connect_bd_intf_net [get_bd_intf_pins StreamingDataWidthConverter_Batch_2/out_V] [get_bd_intf_pins StreamingFIFO_8/in0_V]
connect_bd_intf_net [get_bd_intf_pins StreamingDataWidthConverter_Batch_20/out_V] [get_bd_intf_pins StreamingMaxPool_Batch_6/in0_V]
connect_bd_intf_net [get_bd_intf_pins StreamingFCLayer_Batch_6/out_V] [get_bd_intf_pins StreamingDataWidthConverter_Batch_20/in0_V]
connect_bd_intf_net [get_bd_intf_pins StreamingMaxPool_Batch_6/out_V] [get_bd_intf_pins StreamingDataWidthConverter_Batch_21/in0_V]
connect_bd_intf_net [get_bd_intf_pins StreamingFIFO_45/out_V] [get_bd_intf_pins ConvolutionInputGenerator_6/in0_V]
connect_bd_intf_net [get_bd_intf_pins StreamingFIFO_2/out_V] [get_bd_intf_pins ConvolutionInputGenerator_0/in0_V]
connect_bd_intf_net [get_bd_intf_pins StreamingFIFO_1/out_V] [get_bd_intf_pins FMPadding_Batch_0/in0_V]
connect_bd_intf_net [get_bd_intf_pins StreamingFIFO_0/out_V] [get_bd_intf_pins Thresholding_Batch_0/in0_V]
connect_bd_intf_net [get_bd_intf_pins StreamingDataWidthConverter_Batch_0/out_V] [get_bd_intf_pins StreamingFIFO_4/in0_V]
connect_bd_intf_net [get_bd_intf_pins StreamingFIFO_6/out_V] [get_bd_intf_pins StreamingMaxPool_Batch_0/in0_V]
connect_bd_intf_net [get_bd_intf_pins StreamingMaxPool_Batch_0/out_V] [get_bd_intf_pins StreamingFIFO_7/in0_V]
connect_bd_intf_net [get_bd_intf_pins FMPadding_Batch_1/out_V] [get_bd_intf_pins StreamingDataWidthConverter_Batch_3/in0_V]
connect_bd_intf_net [get_bd_intf_pins StreamingFIFO_10/out_V] [get_bd_intf_pins ConvolutionInputGenerator_1/in0_V]
connect_bd_intf_net [get_bd_intf_pins StreamingDataWidthConverter_Batch_4/out_V] [get_bd_intf_pins StreamingFIFO_12/in0_V]
connect_bd_intf_net [get_bd_intf_pins StreamingMaxPool_Batch_1/out_V] [get_bd_intf_pins StreamingFIFO_15/in0_V]
connect_bd_intf_net [get_bd_intf_pins StreamingFIFO_15/out_V] [get_bd_intf_pins StreamingDataWidthConverter_Batch_6/in0_V]
connect_bd_intf_net [get_bd_intf_pins StreamingDataWidthConverter_Batch_6/out_V] [get_bd_intf_pins StreamingFIFO_16/in0_V]
connect_bd_intf_net [get_bd_intf_pins StreamingFIFO_17/out_V] [get_bd_intf_pins ConvolutionInputGenerator_2/in0_V]
connect_bd_intf_net [get_bd_intf_pins StreamingDataWidthConverter_Batch_7/out_V] [get_bd_intf_pins StreamingFIFO_19/in0_V]
connect_bd_intf_net [get_bd_intf_pins StreamingFIFO_19/out_V] [get_bd_intf_pins StreamingFCLayer_Batch_2/in0_V]
connect_bd_intf_net [get_bd_intf_pins StreamingFIFO_22/out_V] [get_bd_intf_pins StreamingDataWidthConverter_Batch_9/in0_V]
connect_bd_intf_net [get_bd_intf_pins StreamingDataWidthConverter_Batch_9/out_V] [get_bd_intf_pins StreamingFIFO_23/in0_V]
connect_bd_intf_net [get_bd_intf_pins StreamingFIFO_23/out_V] [get_bd_intf_pins FMPadding_Batch_3/in0_V]
connect_bd_intf_net [get_bd_intf_pins FMPadding_Batch_3/out_V] [get_bd_intf_pins StreamingFIFO_24/in0_V]
connect_bd_intf_net [get_bd_intf_pins StreamingDataWidthConverter_Batch_10/out_V] [get_bd_intf_pins StreamingFIFO_26/in0_V]
connect_bd_intf_net [get_bd_intf_pins StreamingFIFO_26/out_V] [get_bd_intf_pins StreamingFCLayer_Batch_3/in0_V]
connect_bd_intf_net [get_bd_intf_pins StreamingMaxPool_Batch_3/out_V] [get_bd_intf_pins StreamingFIFO_29/in0_V]
connect_bd_intf_net [get_bd_intf_pins StreamingDataWidthConverter_Batch_12/out_V] [get_bd_intf_pins StreamingFIFO_30/in0_V]
connect_bd_intf_net [get_bd_intf_pins StreamingFIFO_30/out_V] [get_bd_intf_pins FMPadding_Batch_4/in0_V]
connect_bd_intf_net [get_bd_intf_pins FMPadding_Batch_4/out_V] [get_bd_intf_pins StreamingFIFO_31/in0_V]
connect_bd_intf_net [get_bd_intf_pins StreamingFIFO_40/out_V] [get_bd_intf_pins StreamingFCLayer_Batch_5/in0_V]
connect_bd_intf_net [get_bd_intf_pins StreamingFCLayer_Batch_5/out_V] [get_bd_intf_pins StreamingDataWidthConverter_Batch_17/in0_V]
connect_bd_intf_net [get_bd_intf_pins ConvolutionInputGenerator_5/out_V] [get_bd_intf_pins StreamingDataWidthConverter_Batch_16/in0_V]
connect_bd_intf_net [get_bd_intf_pins StreamingFCLayer_Batch_3/out_V] [get_bd_intf_pins StreamingDataWidthConverter_Batch_11/in0_V]
connect_bd_intf_net [get_bd_intf_pins ConvolutionInputGenerator_4/out_V] [get_bd_intf_pins StreamingDataWidthConverter_Batch_13/in0_V]
connect_bd_intf_net [get_bd_intf_pins StreamingDataWidthConverter_Batch_5/out_V] [get_bd_intf_pins StreamingMaxPool_Batch_1/in0_V]
connect_bd_intf_net [get_bd_intf_pins StreamingFCLayer_Batch_1/out_V] [get_bd_intf_pins StreamingDataWidthConverter_Batch_5/in0_V]
connect_bd_intf_net [get_bd_intf_pins FMPadding_Batch_6/out_V] [get_bd_intf_pins StreamingFIFO_45/in0_V]
connect_bd_net -net ap_clk_0_1 [get_bd_pins ap_clk] \
  [get_bd_pins Thresholding_Batch_0/ap_clk] [get_bd_pins StreamingFIFO_1/ap_clk] [get_bd_pins FMPadding_Batch_0/ap_clk] \
  [get_bd_pins StreamingFIFO_2/ap_clk] [get_bd_pins ConvolutionInputGenerator_0/ap_clk] \
  [get_bd_pins StreamingDataWidthConverter_Batch_0/ap_clk] [get_bd_pins StreamingFIFO_4/ap_clk] \
  [get_bd_pins StreamingFCLayer_Batch_0/ap_clk] [get_bd_pins StreamingDataWidthConverter_Batch_1/ap_clk] \
  [get_bd_pins StreamingFIFO_6/ap_clk] [get_bd_pins StreamingMaxPool_Batch_0/ap_clk] [get_bd_pins StreamingFIFO_7/ap_clk] \
  [get_bd_pins StreamingDataWidthConverter_Batch_2/ap_clk] [get_bd_pins StreamingFIFO_8/ap_clk] \
  [get_bd_pins FMPadding_Batch_1/ap_clk] [get_bd_pins StreamingDataWidthConverter_Batch_3/ap_clk] \
  [get_bd_pins StreamingFIFO_10/ap_clk] [get_bd_pins ConvolutionInputGenerator_1/ap_clk] \
  [get_bd_pins StreamingDataWidthConverter_Batch_4/ap_clk] [get_bd_pins StreamingFIFO_12/ap_clk] \
  [get_bd_pins StreamingFCLayer_Batch_1/ap_clk] [get_bd_pins StreamingDataWidthConverter_Batch_5/ap_clk] \
  [get_bd_pins StreamingMaxPool_Batch_1/ap_clk] [get_bd_pins StreamingFIFO_15/ap_clk] \
  [get_bd_pins StreamingDataWidthConverter_Batch_6/ap_clk] [get_bd_pins StreamingFIFO_16/ap_clk] \
  [get_bd_pins FMPadding_Batch_2/ap_clk] [get_bd_pins StreamingFIFO_17/ap_clk] \
  [get_bd_pins ConvolutionInputGenerator_2/ap_clk] [get_bd_pins StreamingDataWidthConverter_Batch_7/ap_clk] \
  [get_bd_pins StreamingFIFO_19/ap_clk] [get_bd_pins StreamingFCLayer_Batch_2/ap_clk] \
  [get_bd_pins StreamingDataWidthConverter_Batch_8/ap_clk] [get_bd_pins StreamingMaxPool_Batch_2/ap_clk] \
  [get_bd_pins StreamingFIFO_22/ap_clk] [get_bd_pins StreamingDataWidthConverter_Batch_9/ap_clk] \
  [get_bd_pins StreamingFIFO_23/ap_clk] [get_bd_pins FMPadding_Batch_3/ap_clk] [get_bd_pins StreamingFIFO_24/ap_clk] \
  [get_bd_pins ConvolutionInputGenerator_3/ap_clk] [get_bd_pins StreamingDataWidthConverter_Batch_10/ap_clk] \
  [get_bd_pins StreamingFIFO_26/ap_clk] [get_bd_pins StreamingFCLayer_Batch_3/ap_clk] \
  [get_bd_pins StreamingDataWidthConverter_Batch_11/ap_clk] [get_bd_pins StreamingMaxPool_Batch_3/ap_clk] \
  [get_bd_pins StreamingFIFO_29/ap_clk] [get_bd_pins StreamingDataWidthConverter_Batch_12/ap_clk] \
  [get_bd_pins StreamingFIFO_30/ap_clk] [get_bd_pins FMPadding_Batch_4/ap_clk] [get_bd_pins StreamingFIFO_31/ap_clk] \
  [get_bd_pins ConvolutionInputGenerator_4/ap_clk] [get_bd_pins StreamingDataWidthConverter_Batch_13/ap_clk] \
  [get_bd_pins StreamingFIFO_33/ap_clk] [get_bd_pins StreamingFCLayer_Batch_4/ap_clk] \
  [get_bd_pins StreamingDataWidthConverter_Batch_14/ap_clk] [get_bd_pins StreamingMaxPool_Batch_4/ap_clk] \
  [get_bd_pins StreamingFIFO_36/ap_clk] [get_bd_pins StreamingDataWidthConverter_Batch_15/ap_clk] \
  [get_bd_pins StreamingFIFO_37/ap_clk] [get_bd_pins FMPadding_Batch_5/ap_clk] [get_bd_pins StreamingFIFO_38/ap_clk] \
  [get_bd_pins ConvolutionInputGenerator_5/ap_clk] [get_bd_pins StreamingDataWidthConverter_Batch_16/ap_clk] \
  [get_bd_pins StreamingFIFO_40/ap_clk] [get_bd_pins StreamingFCLayer_Batch_5/ap_clk] \
  [get_bd_pins StreamingDataWidthConverter_Batch_17/ap_clk] [get_bd_pins StreamingMaxPool_Batch_5/ap_clk] \
  [get_bd_pins StreamingDataWidthConverter_Batch_18/ap_clk] [get_bd_pins StreamingFIFO_44/ap_clk] \
  [get_bd_pins FMPadding_Batch_6/ap_clk] [get_bd_pins StreamingFIFO_45/ap_clk] \
  [get_bd_pins ConvolutionInputGenerator_6/ap_clk] [get_bd_pins StreamingDataWidthConverter_Batch_19/ap_clk] \
  [get_bd_pins StreamingFIFO_47/ap_clk] [get_bd_pins StreamingFCLayer_Batch_6/ap_clk] \
  [get_bd_pins StreamingDataWidthConverter_Batch_20/ap_clk] [get_bd_pins StreamingMaxPool_Batch_6/ap_clk] \
  [get_bd_pins StreamingDataWidthConverter_Batch_21/ap_clk] [get_bd_pins StreamingFCLayer_Batch_7/ap_clk] \
  [get_bd_pins StreamingDataWidthConverter_Batch_22/ap_clk] [get_bd_pins StreamingFCLayer_Batch_8/ap_clk] \
  [get_bd_pins StreamingDataWidthConverter_Batch_23/ap_clk] [get_bd_pins StreamingFCLayer_Batch_9/ap_clk] \
  [get_bd_pins StreamingFIFO_0/ap_clk]
connect_bd_net -net ap_rst_n_0_1 [get_bd_pins ap_rst_n] \
  [get_bd_pins Thresholding_Batch_0/ap_rst_n] [get_bd_pins StreamingFIFO_1/ap_rst_n] [get_bd_pins FMPadding_Batch_0/ap_rst_n] \
  [get_bd_pins StreamingFIFO_2/ap_rst_n] [get_bd_pins ConvolutionInputGenerator_0/ap_rst_n] \
  [get_bd_pins StreamingDataWidthConverter_Batch_0/ap_rst_n] [get_bd_pins StreamingFIFO_4/ap_rst_n] \
  [get_bd_pins StreamingFCLayer_Batch_0/ap_rst_n] [get_bd_pins StreamingDataWidthConverter_Batch_1/ap_rst_n] \
  [get_bd_pins StreamingFIFO_6/ap_rst_n] [get_bd_pins StreamingMaxPool_Batch_0/ap_rst_n] \
  [get_bd_pins StreamingFIFO_7/ap_rst_n] [get_bd_pins StreamingDataWidthConverter_Batch_2/ap_rst_n] \
  [get_bd_pins StreamingFIFO_8/ap_rst_n] [get_bd_pins FMPadding_Batch_1/ap_rst_n] \
  [get_bd_pins StreamingDataWidthConverter_Batch_3/ap_rst_n] [get_bd_pins StreamingFIFO_10/ap_rst_n] \
  [get_bd_pins ConvolutionInputGenerator_1/ap_rst_n] [get_bd_pins StreamingDataWidthConverter_Batch_4/ap_rst_n] \
  [get_bd_pins StreamingFIFO_12/ap_rst_n] [get_bd_pins StreamingFCLayer_Batch_1/ap_rst_n] \
  [get_bd_pins StreamingDataWidthConverter_Batch_5/ap_rst_n] [get_bd_pins StreamingMaxPool_Batch_1/ap_rst_n] \
  [get_bd_pins StreamingFIFO_15/ap_rst_n] [get_bd_pins StreamingDataWidthConverter_Batch_6/ap_rst_n] \
  [get_bd_pins StreamingFIFO_16/ap_rst_n] [get_bd_pins FMPadding_Batch_2/ap_rst_n] [get_bd_pins StreamingFIFO_17/ap_rst_n] \
  [get_bd_pins ConvolutionInputGenerator_2/ap_rst_n] [get_bd_pins StreamingDataWidthConverter_Batch_7/ap_rst_n] \
  [get_bd_pins StreamingFIFO_19/ap_rst_n] [get_bd_pins StreamingFCLayer_Batch_2/ap_rst_n] \
  [get_bd_pins StreamingDataWidthConverter_Batch_8/ap_rst_n] [get_bd_pins StreamingMaxPool_Batch_2/ap_rst_n] \
  [get_bd_pins StreamingFIFO_22/ap_rst_n] [get_bd_pins StreamingDataWidthConverter_Batch_9/ap_rst_n] \
  [get_bd_pins StreamingFIFO_23/ap_rst_n] [get_bd_pins FMPadding_Batch_3/ap_rst_n] [get_bd_pins StreamingFIFO_24/ap_rst_n] \
  [get_bd_pins ConvolutionInputGenerator_3/ap_rst_n] [get_bd_pins StreamingDataWidthConverter_Batch_10/ap_rst_n] \
  [get_bd_pins StreamingFIFO_26/ap_rst_n] [get_bd_pins StreamingFCLayer_Batch_3/ap_rst_n] \
  [get_bd_pins StreamingDataWidthConverter_Batch_11/ap_rst_n] [get_bd_pins StreamingMaxPool_Batch_3/ap_rst_n] \
  [get_bd_pins StreamingFIFO_29/ap_rst_n] [get_bd_pins StreamingDataWidthConverter_Batch_12/ap_rst_n] \
  [get_bd_pins StreamingFIFO_30/ap_rst_n] [get_bd_pins FMPadding_Batch_4/ap_rst_n] [get_bd_pins StreamingFIFO_31/ap_rst_n] \
  [get_bd_pins ConvolutionInputGenerator_4/ap_rst_n] [get_bd_pins StreamingDataWidthConverter_Batch_13/ap_rst_n] \
  [get_bd_pins StreamingFIFO_33/ap_rst_n] [get_bd_pins StreamingFCLayer_Batch_4/ap_rst_n] \
  [get_bd_pins StreamingDataWidthConverter_Batch_14/ap_rst_n] [get_bd_pins StreamingMaxPool_Batch_4/ap_rst_n] \
  [get_bd_pins StreamingFIFO_36/ap_rst_n] [get_bd_pins StreamingDataWidthConverter_Batch_15/ap_rst_n] \
  [get_bd_pins StreamingFIFO_37/ap_rst_n] [get_bd_pins FMPadding_Batch_5/ap_rst_n] [get_bd_pins StreamingFIFO_38/ap_rst_n] \
  [get_bd_pins ConvolutionInputGenerator_5/ap_rst_n] [get_bd_pins StreamingDataWidthConverter_Batch_16/ap_rst_n] \
  [get_bd_pins StreamingFIFO_40/ap_rst_n] [get_bd_pins StreamingFCLayer_Batch_5/ap_rst_n] \
  [get_bd_pins StreamingDataWidthConverter_Batch_17/ap_rst_n] [get_bd_pins StreamingMaxPool_Batch_5/ap_rst_n] \
  [get_bd_pins StreamingDataWidthConverter_Batch_18/ap_rst_n] [get_bd_pins StreamingFIFO_44/ap_rst_n] \
  [get_bd_pins FMPadding_Batch_6/ap_rst_n] [get_bd_pins StreamingFIFO_45/ap_rst_n] \
  [get_bd_pins ConvolutionInputGenerator_6/ap_rst_n] [get_bd_pins StreamingDataWidthConverter_Batch_19/ap_rst_n] \
  [get_bd_pins StreamingFIFO_47/ap_rst_n] [get_bd_pins StreamingFCLayer_Batch_6/ap_rst_n] \
  [get_bd_pins StreamingDataWidthConverter_Batch_20/ap_rst_n] [get_bd_pins StreamingMaxPool_Batch_6/ap_rst_n] \
  [get_bd_pins StreamingDataWidthConverter_Batch_21/ap_rst_n] [get_bd_pins StreamingFCLayer_Batch_7/ap_rst_n] \
  [get_bd_pins StreamingDataWidthConverter_Batch_22/ap_rst_n] [get_bd_pins StreamingFCLayer_Batch_8/ap_rst_n] \
  [get_bd_pins StreamingDataWidthConverter_Batch_23/ap_rst_n] [get_bd_pins StreamingFCLayer_Batch_9/ap_rst_n] \
  [get_bd_pins StreamingFIFO_0/ap_rst_n]
